# Altium schematic sheet multiplexer-ic.SchDoc: ADG658
size A4; DrawnBy: Dylan Vogel; Organization: UTAT SS; DocumentNumber: 13; Revision: 2; SheetNumber: 13; SheetTotal: 13
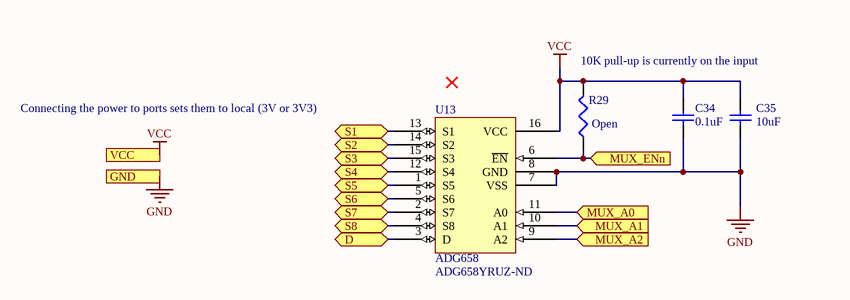
[diagram p0: multiplexer-ic.SchDoc]

## Parts
C34  0.1uF  [0402]
C35  10uF  [1608[0603]]
R29  value Open  [0402]  (hidden comment: Optional 10K)
U13  ADG658  Supplier Part Number 1: ADG658YRUZ-ND  [SSOP16_N]

## Ports
D (bidir), GND, MUX_A0 (in), MUX_A1 (in), MUX_A2 (in), MUX_ENn (in), S1 (bidir), S2 (bidir), S3 (bidir), S4 (bidir), S5 (bidir), S6 (bidir), S7 (bidir), S8 (bidir), VCC

## Nets
GND: C34.1 C35.1 U13.7(VSS) U13.8(GND) ; port GND
VCC: C34.2 C35.2 R29.2 U13.16(VCC) ; port VCC
D: U13.3(D) ; port D
MUX_A0: U13.11(A0) ; port MUX_A0
MUX_A1: U13.10(A1) ; port MUX_A1
MUX_A2: U13.9(A2) ; port MUX_A2
MUX_ENn: R29.1 U13.6(~{EN}) ; port MUX_ENn
S1: U13.13(S1) ; port S1
S2: U13.14(S2) ; port S2
S3: U13.15(S3) ; port S3
S4: U13.12(S4) ; port S4
S5: U13.1(S5) ; port S5
S6: U13.5(S6) ; port S6
S7: U13.2(S7) ; port S7
S8: U13.4(S8) ; port S8

## Notes on the sheet
- 10K pull-up is currently on the input
- (near U13) Connecting the power to ports sets them to local (3V or 3V3)

## Library data of the parts
C34 C35 = Cap Semi: Capacitor (Semiconductor SIM Model); Published: 8-Jun-2000; LatestRevisionDate: 29-May-2009; LatestRevisionNote: IPC-7351 Footprint Added.; PackageReference: C1206; Publisher: Altium Limited; PackageDescription: Chip Capacitor; Supplier: Digi-Key; Supplier 1: Digi-Key
  C34: Value: 0.1uF
  C35: Value: 10uF
R29 = Res3: Resistor; Published: 8-Jun-2000; LatestRevisionDate: 29-May-2009; LatestRevisionNote: IPC-7351 Footprint Added.; PackageReference: J1-0603; Publisher: Altium Limited; PackageDescription: Chip Resistor; Supplier: Digi-Key; Supplier 1: Digi-Key
U13 = ADG658: Eight channel analog multiplexer.; Supplier 1: Digi-Key; Supplier: Digi-Key